# Altium schematic sheet SolarTrackingSystemMPPT.SchDoc
size A4; SheetNumber: 1; SheetTotal: 1
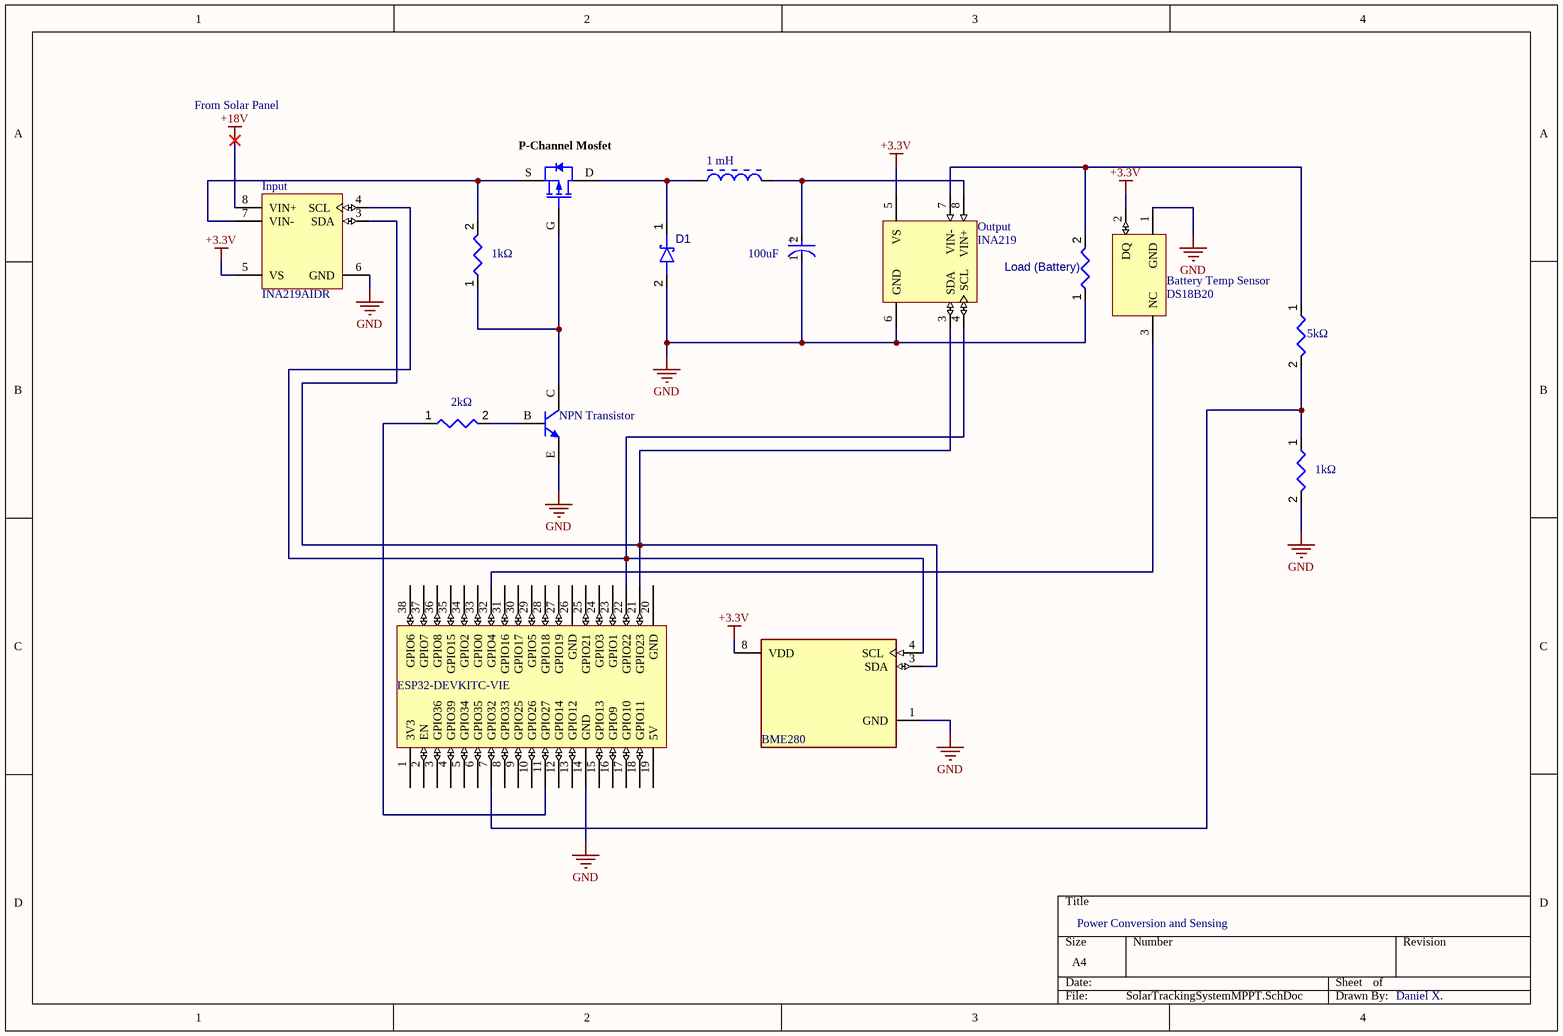
[diagram p0: SolarTrackingSystemMPPT.SchDoc]

## Parts
1_mH  AIRD-03-102K  [BOUR-1130-102K_122K-2_V]  (value not drawn)
100uF  Capacitance: 100uF  [FP-35ZLH100MEFC6_3X11-MFG]  (hidden comment: Panasonic EEU-FR1V101B)
*?  ESP32-DEVKITC-VIE  [ESP32-DEVKITC-VIE-Footprint-1]
Battery_Temp_Sensor  DS18B20  [Q3+4]
D1  1N5819 Schottky  [MicroSMP (DO-219AD)]  (value not drawn)
Input  INA219AIDR  [D0008A_L]
Load_(Battery)  MFR-25FBF52-1K  [RESA60-630X240]  (value not drawn)
NPN_Transistor  P2N2222AG  [ONSC-TO-92-3-29-11]  (value not drawn)
Output  INA219  [D0008A_L]
P-Channel_Mosfet  FQP27P06  [FAIR-TO-220-3]  (value not drawn)
R1  value 1kΩ  [RESA60-630X240]  (hidden comment: MFR-25FBF52-1K)
R2  value 2kΩ  [RESA60-630X240]  (hidden comment: MFR-25FBF52-1K)
R3  value 1kΩ  [RESA60-630X240]  (hidden comment: MFR-25FBF52-1K)
R4  value 5kΩ  [RESA60-630X240]  (hidden comment: MFR-25FBF52-1K)
U2  BME280  [FP-BME280-MFG]

## Nets
+3.3V: Battery_Temp_Sensor.2(DQ) Input.5(VS) Output.5(VS) U2.8(VDD)
+18V: Input.8(VIN+)
GND: 100uF.1(C) *?.14(GND) Battery_Temp_Sensor.1(GND) D1.2(A) Input.6(GND) Load_(Battery).1 NPN_Transistor.E Output.6(GND) R3.2 U2.1(GND)
Net1_mH_1: 1_mH.1 D1.1(K) P-Channel_Mosfet.D
Net1_mH_2: 1_mH.2 100uF.2(A) Output.8(VIN+)
Net*?_7: *?.7(GPIO32) R3.1 R4.2
Net*?_11: *?.11(GPIO27) R2.1
Net*?_21: *?.21(GPIO23) Input.3(SDA) Output.3(SDA) U2.3(SDA)
Net*?_22: *?.22(GPIO22) Input.4(SCL) Output.4(SCL) U2.4(SCL)
Net*?_32: *?.32(GPIO4) Battery_Temp_Sensor.3(NC)
NetInput_7: Input.7(VIN-) P-Channel_Mosfet.S R1.2
NetLoad_(Battery)_2: Load_(Battery).2 Output.7(VIN-) R4.1
NetNPN_Transistor_B: NPN_Transistor.B R2.2
NetNPN_Transistor_C: NPN_Transistor.C P-Channel_Mosfet.G R1.1

Not connected (* = marked no-connect by the designer): *? 1(3V3) 2(EN) 3(GPIO36) 4(GPIO39) 5(GPIO34) 6(GPIO35) 8(GPIO33) 9(GPIO25) 10(GPIO26) 12(GPIO14) 13(GPIO12) 15(GPIO13) 16(GPIO9) 17(GPIO10) 18(GPIO11) 19(5V) 20(GND) 23(GPIO1) 24(GPIO3) 25(GPIO21) 26(GND) 27(GPIO19) 28(GPIO18) 29(GPIO5) 30(GPIO17) 31(GPIO16) 33(GPIO0) 34(GPIO2) 35(GPIO15) 36(GPIO8) 37(GPIO7) 38(GPIO6)

## Notes on the sheet
- From Solar Panel
- Power Conversion and Sensing
- Daniel X.
- (in symbol CMP-35376-000014-1) +

## Library data of the parts
1_mH = CMP-1227-00001-1: High Current Choke, 1000 uH +/-20%, -55 to 105 degC, 2-Pin THD, RoHS; PartNumber: 1130-102K-RC; Manufacturer: Bourns; IDC: 2 A; DCR: 0.426 Ohm Max.; ComponentLink3URL: https://www.bourns.com/data/global/pdfs/1130_series.pdf; L@1 KHz: 1000 uH +/- 20%; ComponentLink1URL: https://www.bourns.com/; Operating Temperature: -55 to 105 degC; Mounting Technology: Through Hole; ComponentLink1Description: Manufacturer URL; RoHS: TRUE; ComponentLink2URL: https://www.bourns.com/data/global/pdfs/1130_series.pdf; ComponentLink2Description: Datasheet; ComponentLink3Description: Package Specification; PackageDescription: 2-Pin Through Hole Device, Dia 27.94 mm, Height 21.336 mm, Pin Spacing 19.05 mm; DatasheetVersion: Rev. 05/08
100uF = CMP-35376-000014-1: CAP ALUM 100UF 20% 35V RADIAL; Lead Diameter: 0.5mm; Leakage Current: 3uA; Ripple Current (AC): 540mA; Life (Hours): 6000Hour; Dielectric Material: Aluminium; Impedance: 94mR; Number of Pins: 2; Voltage: 35V; Case/Package: Radial; Min Operating Temperature: -40°C; Height - Seated (Max): 0.492inch; Height: 11mm; Tolerance: 20%; REACH SVHC: No SVHC; Series: ZLH; Radiation Hardening: No; Ripple Current: 540mA; Package Quantity: 2000; Max Operating Temperature: 105°C; Lead Pitch: 2.5mm; Termination: Radial; Voltage Rating: 35V; Diameter: 6.3mm; Packaging: Bulk; Construction: RADIAL; Voltage Rating (DC): 35V; Mount: Through Hole; RoHS Compliant: Yes
*? = CMP-00025-00003-3: ESP32-WROVER-IE Series Evaluation Board 802.11 b/g/n (WiFi, WLAN) Bluetooth Smart Ready 4.x Dual Mode
Battery_Temp_Sensor = CMP-0253-00002-1: High-Precision Parasite-Power Digital Thermometer, 1-Wire Interface, ±0.5°C Accuracy, 3-Pin TO92, -55°C to +125°C, Tape and Reel, Pb-Free; ComponentLink1URL: http://www.maxim-ic.com; PackageDescription: TO-92 Package, Formed Leads, Body Dia. 4.7mm; Leads 0.51 x 0.51 mm (max), Pb-Free; ComponentLink1Description: Manufacturer URL; ComponentLink2URL: http://datasheets.maxim-ic.com/en/ds/DS18B20-PAR.pdf; Code_JEDEC: TO-226-AA; DatasheetVersion: 2007; ComponentLink2Description: Datasheet; PackageReference: Q3+4; PackageVersion: revB, 2010
D1 = CMP-004-00024-3: Schottky Diodes & Rectifiers 1.0 Amp 40 Volt; Forward Voltage: 460mV; Max Surge Current: 25A; Max Operating Temperature: 150°C; Min Operating Temperature: -55°C; Pins: 2; Mounting Technology: SMT
Input = CMP-0704-00003-2: Zero-Drift, Bi-Directional Current / Power Monitor, 3 to 5.5 V, -40 to 125 degC, 8-pin SOIC (D8), Green (RoHS & no Sb/Br); Manufacturer: Texas Instruments; Common Mode Range(Min)(V): 0; SubFamily: Current Shunt Monitor; Rating: Catalog; Input Offset (+/-)(Max)(uV): 100; Vs(Max)(V): 5.5; Common Mode Range(Max)(V): 26; Quiescent Current (+/-)(Typ)(mA): 0.7; Vs(Min)(V): 3; Gain(V/V): 1, 0.5, 0.25, 0.125; Small-Signal Bandwidth(Typ)(MHz): 0.011; PackageReference: D0008A; ComponentLink1URL: http://www.ti.com/; Eco-Plan: Green (RoHS & no Sb/Br); ComponentLink2URL: http://www.ti.com/general/docs/lit/getliterature.tsp?genericPartNumber=INA219&fileType=pdf; ComponentLink1Description: Manufacturer URL; ComponentLink3Description: Package Specification; Mounting Technology: Surface Mount; PackageDescription: 8-Pin Plastic Small Outline, Body 4.9 x 3.9 mm, Pitch 1.27 mm; ComponentLink3URL: http://www.ti.com/lit/ml/msoi002j/msoi002j.pdf; DatasheetVersion: SBOS448F; PackageVersion: 4040047-3/M, 06/2011; PartNumber: INA219AIDR; Code_JEDEC: MS-012; ComponentLink2Description: Datasheet; CMRR(Min)(dB): 100
Load_(Battery) = CMP-009-00048-4: Axial Resistor, 1 KOhm, +/- 1%, 250 mW, -55 to 155 degC, 2-Pin THD, RoHS, Bulk; Manufacturer: Yageo; Voltage Rating: 250V; Value: 56Ω; Power: 2W; Min Operating Temperature: -55°C; Max Operating Temperature: 155°C; Tolerance: 1%; Package Reference: MFR-25; Composition: CarbonFilm; Mounting Technology: TH; Packaging: Bulk; Case/Package: Axial; Datasheet URL: http://www.yageo.com/documents/recent/Yageo%20LR_MFR_2013.pdf; Package Quantity: 200; Manufacturer URL: http://www.yageo.com/; Package Description: 2-Pin Axial Lead, Dia 2.4 mm, Body Length 6.3 mm; Datasheet Version: Apr-13; RoHS Compliant: True
NPN_Transistor = CMP-1048-01402-1: Amplifier Transistor, NPN Silicon, 3-Pin TO-92, Pb-Free, Bulk Box; Manufacturer: On Semiconductor; IC Continuous (A): 0.6; fT Min (MHz): 300; ComponentLink2Description: Datasheet; ComponentLink1Description: Manufacturer URL; ComponentLink2URL: http://www.onsemi.com/pub_link/Collateral/P2N2222A-D.PDF; ComponentLink3Description: Package Specification; RoHS: TRUE; ComponentLink1URL: http://www.onsemi.com/; PartNumber: P2N2222AG; Mounting Technology: Through Hole; PackageReference: TO-92-3-29-11_AM_SL; Polarity: NPN; Packing: Bulk Box; DatasheetVersion: Rev. 7; PackageDescription: 3-Pin Transistor Outline, Body 4.825 x 3.685 mm, Pitch 1.27 mm; PackageVersion: Rev. AM; ComponentLink3URL: http://www.onsemi.cn/pub_link/Collateral/2N6426-D.PDF
Output = CMP-0704-00003-2: Zero-Drift, Bi-Directional Current / Power Monitor, 3 to 5.5 V, -40 to 125 degC, 8-pin SOIC (D8), Green (RoHS & no Sb/Br); Manufacturer: Texas Instruments; PartNumber: INA219AIDR; Common Mode Range(Min)(V): 0; SubFamily: Current Shunt Monitor; Rating: Catalog; Input Offset (+/-)(Max)(uV): 100; Vs(Max)(V): 5.5; Common Mode Range(Max)(V): 26; Quiescent Current (+/-)(Typ)(mA): 0.7; Vs(Min)(V): 3; Gain(V/V): 1, 0.5, 0.25, 0.125; Small-Signal Bandwidth(Typ)(MHz): 0.011; PackageReference: D0008A; ComponentLink1URL: http://www.ti.com/; Eco-Plan: Green (RoHS & no Sb/Br); ComponentLink2URL: http://www.ti.com/general/docs/lit/getliterature.tsp?genericPartNumber=INA219&fileType=pdf; ComponentLink1Description: Manufacturer URL; ComponentLink3Description: Package Specification; Mounting Technology: Surface Mount; PackageDescription: 8-Pin Plastic Small Outline, Body 4.9 x 3.9 mm, Pitch 1.27 mm; ComponentLink3URL: http://www.ti.com/lit/ml/msoi002j/msoi002j.pdf; DatasheetVersion: SBOS448F; PackageVersion: 4040047-3/M, 06/2011; Code_JEDEC: MS-012; ComponentLink2Description: Datasheet; CMRR(Min)(dB): 100
P-Channel_Mosfet = CMP-2000-04936-1: P-Channel QFET(R) MOSFET, -60 V, -27 A, -55 to 175 degC, 3-Pin TO-220, RoHS, Tube; Manufacturer: Fairchild; Rated Power Dissipation: 120W; Qg Gate Charge: 33nC; Drain-Source On Resistance-Max: 0.07O; Drain-to-Source Voltage [Vdss]: 60V; Package Reference: TO-220; Datasheet URL: https://www.fairchildsemi.com/datasheets/FQ/FQP27P06.pdf; Datasheet Version: Mar-13; Package Description: 3-Pin Through Hole Device, Body 10 x 4.5 mm, Pitch 2.54 mm; Package URL: https://www.fairchildsemi.com/package-drawings/TO/TO220B03.pdf; Channel Type: P-Channel; Manufacturer URL: https://www.fairchildsemi.com/
R1 R2 = CMP-009-00048-4: Axial Resistor, 1 KOhm, +/- 1%, 250 mW, -55 to 155 degC, 2-Pin THD, RoHS, Bulk; Manufacturer: Yageo; Voltage Rating: 250V; Power: 2W; Min Operating Temperature: -55°C; Max Operating Temperature: 155°C; Tolerance: 1%; Package Reference: MFR-25; Composition: CarbonFilm; Mounting Technology: TH; Packaging: Bulk; Case/Package: Axial; Datasheet URL: http://www.yageo.com/documents/recent/Yageo%20LR_MFR_2013.pdf; Package Quantity: 200; Manufacturer URL: http://www.yageo.com/; Package Description: 2-Pin Axial Lead, Dia 2.4 mm, Body Length 6.3 mm; Datasheet Version: Apr-13; RoHS Compliant: True
R3 R4 = CMP-009-00048-4: Axial Resistor, 1 KOhm, +/- 1%, 250 mW, -55 to 155 degC, 2-Pin THD, RoHS, Bulk; Manufacturer: Yageo; Voltage Rating: 250V; Power: 250mW; Min Operating Temperature: -55°C; Max Operating Temperature: 155°C; Tolerance: 1%; Package Reference: MFR-25; Composition: CarbonFilm; Mounting Technology: TH; Packaging: Bulk; Case/Package: Axial; Datasheet URL: http://www.yageo.com/documents/recent/Yageo%20LR_MFR_2013.pdf; Package Quantity: 200; Manufacturer URL: http://www.yageo.com/; Package Description: 2-Pin Axial Lead, Dia 2.4 mm, Body Length 6.3 mm; Datasheet Version: Apr-13; RoHS Compliant: True
U2 = CMP-2000-05073-3: SENSOR PRESSURE HUMIDITY TEMP; Sensor Type: Temperature; Accuracy: 3%; Response Time: 1s; Output Type: SPI; Min Operating Temperature: -40°C; Max Operating Temperature: 85°C; Case/Package: LGA; Packaging: Cut Tape; Mount: Surface Mount; Lead Free: Lead Free; Number of Pins: 8